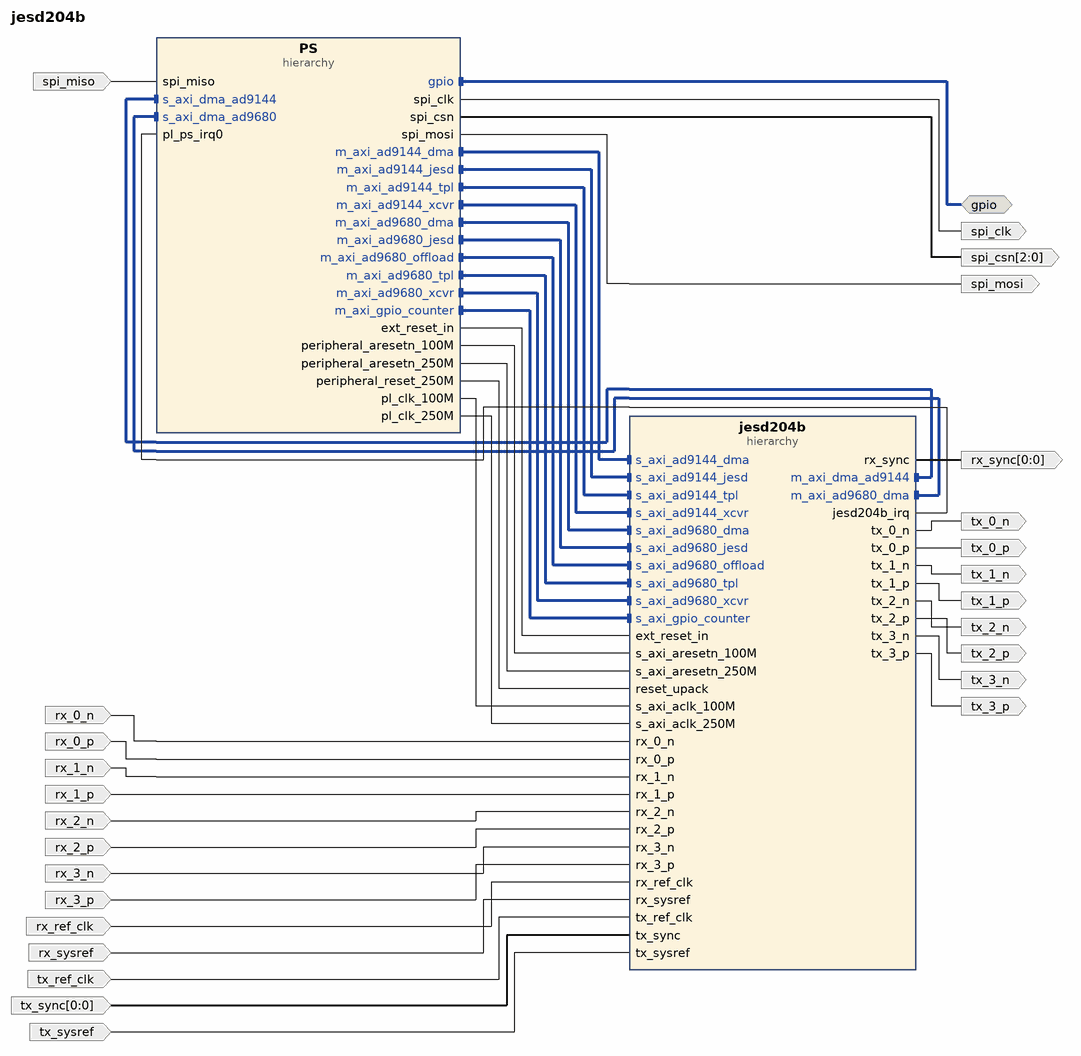
[diagram p0: block diagram of the top level]
# Vivado block design jesd204b, xczu7ev-fbvb900-1-e, Vivado 2022.2
create_bd_design jesd204b

create_bd_intf_port -mode Master -vlnv xilinx.com:interface:gpio_rtl:1.0 gpio
create_bd_port -dir O -from 2 -to 0 spi_csn
create_bd_port -dir O spi_clk
create_bd_port -dir O spi_mosi
create_bd_port -dir I spi_miso
create_bd_port -dir I rx_0_n
create_bd_port -dir I rx_0_p
create_bd_port -dir I rx_1_n
create_bd_port -dir I rx_1_p
create_bd_port -dir I rx_2_n
create_bd_port -dir I rx_2_p
create_bd_port -dir I rx_3_n
create_bd_port -dir I rx_3_p
create_bd_port -dir I rx_ref_clk
create_bd_port -dir I tx_ref_clk
create_bd_port -dir O tx_0_n
create_bd_port -dir O tx_0_p
create_bd_port -dir O tx_1_n
create_bd_port -dir O tx_1_p
create_bd_port -dir O tx_2_n
create_bd_port -dir O tx_2_p
create_bd_port -dir O tx_3_n
create_bd_port -dir O tx_3_p
create_bd_port -dir O -from 0 -to 0 rx_sync
create_bd_port -dir I rx_sysref
create_bd_port -dir I tx_sysref
create_bd_port -dir I -from 0 -to 0 tx_sync

create_bd_cell -type hier PS
create_bd_cell -type hier jesd204b

# ---- hierarchy /PS ----
current_bd_instance /PS
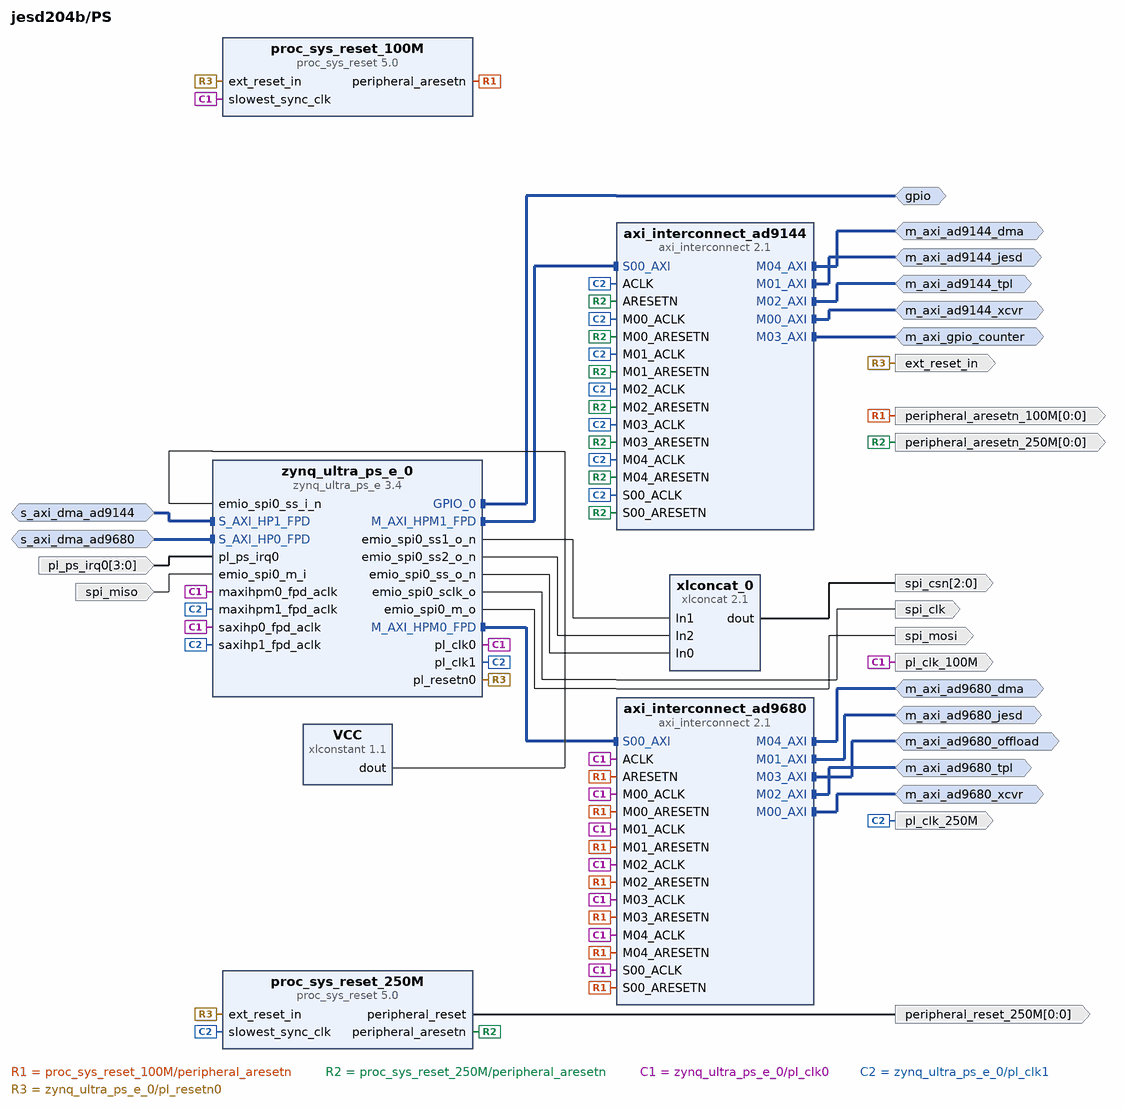
[diagram p1: block diagram inside /PS]
create_bd_intf_pin -mode Slave -vlnv xilinx.com:interface:aximm_rtl:1.0 s_axi_dma_ad9680
create_bd_intf_pin -mode Slave -vlnv xilinx.com:interface:aximm_rtl:1.0 s_axi_dma_ad9144
create_bd_intf_pin -mode Master -vlnv xilinx.com:interface:gpio_rtl:1.0 gpio
create_bd_intf_pin -mode Master -vlnv xilinx.com:interface:aximm_rtl:1.0 m_axi_ad9144_xcvr
create_bd_intf_pin -mode Master -vlnv xilinx.com:interface:aximm_rtl:1.0 m_axi_ad9144_jesd
create_bd_intf_pin -mode Master -vlnv xilinx.com:interface:aximm_rtl:1.0 m_axi_ad9144_tpl
create_bd_intf_pin -mode Master -vlnv xilinx.com:interface:aximm_rtl:1.0 m_axi_gpio_counter
create_bd_intf_pin -mode Master -vlnv xilinx.com:interface:aximm_rtl:1.0 m_axi_ad9144_dma
create_bd_intf_pin -mode Master -vlnv xilinx.com:interface:aximm_rtl:1.0 m_axi_ad9680_xcvr
create_bd_intf_pin -mode Master -vlnv xilinx.com:interface:aximm_rtl:1.0 m_axi_ad9680_jesd
create_bd_intf_pin -mode Master -vlnv xilinx.com:interface:aximm_rtl:1.0 m_axi_ad9680_tpl
create_bd_intf_pin -mode Master -vlnv xilinx.com:interface:aximm_rtl:1.0 m_axi_ad9680_offload
create_bd_intf_pin -mode Master -vlnv xilinx.com:interface:aximm_rtl:1.0 m_axi_ad9680_dma
create_bd_pin -dir O -from 2 -to 0 spi_csn
create_bd_pin -dir O spi_clk
create_bd_pin -dir I spi_miso
create_bd_pin -dir O spi_mosi
create_bd_pin -dir I -from 3 -to 0 pl_ps_irq0
create_bd_pin -dir O pl_clk_250M
create_bd_pin -dir O pl_clk_100M
create_bd_pin -dir O -from 0 -to 0 peripheral_aresetn_100M
create_bd_pin -dir O -from 0 -to 0 peripheral_aresetn_250M
create_bd_pin -dir O -from 0 -to 0 peripheral_reset_250M
create_bd_pin -dir O ext_reset_in

create_bd_cell -type ip -vlnv xilinx.com:ip:zynq_ultra_ps_e:3.4 zynq_ultra_ps_e_0
set_property -dict [list \
  CONFIG.PSU_BANK_0_IO_STANDARD LVCMOS18 \
  CONFIG.PSU_BANK_1_IO_STANDARD LVCMOS18 \
  CONFIG.PSU_BANK_2_IO_STANDARD LVCMOS18 \
  CONFIG.PSU_BANK_3_IO_STANDARD LVCMOS18 \
  CONFIG.PSU__CRF_APB__ACPU_CTRL__FREQMHZ 1200 \
  CONFIG.PSU__CRF_APB__ACPU_CTRL__SRCSEL DPLL \
  CONFIG.PSU__CRF_APB__APLL_CTRL__SRCSEL PSS_REF_CLK \
  CONFIG.PSU__CRF_APB__DBG_FPD_CTRL__FREQMHZ 250 \
  CONFIG.PSU__CRF_APB__DBG_FPD_CTRL__SRCSEL IOPLL \
  CONFIG.PSU__CRF_APB__DBG_TRACE_CTRL__FREQMHZ 250 \
  CONFIG.PSU__CRF_APB__DBG_TRACE_CTRL__SRCSEL IOPLL \
  CONFIG.PSU__CRF_APB__DBG_TSTMP_CTRL__FREQMHZ 250 \
  CONFIG.PSU__CRF_APB__DBG_TSTMP_CTRL__SRCSEL IOPLL \
  CONFIG.PSU__CRF_APB__DDR_CTRL__FREQMHZ 1200 \
  CONFIG.PSU__CRF_APB__DDR_CTRL__SRCSEL DPLL \
  CONFIG.PSU__CRF_APB__DPDMA_REF_CTRL__FREQMHZ 600 \
  CONFIG.PSU__CRF_APB__DPDMA_REF_CTRL__SRCSEL DPLL \
  CONFIG.PSU__CRF_APB__DPLL_CTRL__SRCSEL PSS_REF_CLK \
  CONFIG.PSU__CRF_APB__GDMA_REF_CTRL__FREQMHZ 600 \
  CONFIG.PSU__CRF_APB__GDMA_REF_CTRL__SRCSEL DPLL \
  CONFIG.PSU__CRF_APB__GPU_REF_CTRL__FREQMHZ 500 \
  CONFIG.PSU__CRF_APB__GPU_REF_CTRL__SRCSEL IOPLL \
  CONFIG.PSU__CRF_APB__TOPSW_LSBUS_CTRL__FREQMHZ 100 \
  CONFIG.PSU__CRF_APB__TOPSW_LSBUS_CTRL__SRCSEL IOPLL \
  CONFIG.PSU__CRF_APB__TOPSW_MAIN_CTRL__FREQMHZ 533.33 \
  CONFIG.PSU__CRF_APB__TOPSW_MAIN_CTRL__SRCSEL APLL \
  CONFIG.PSU__CRF_APB__VPLL_CTRL__SRCSEL PSS_REF_CLK \
  CONFIG.PSU__CRL_APB__ADMA_REF_CTRL__FREQMHZ 500 \
  CONFIG.PSU__CRL_APB__ADMA_REF_CTRL__SRCSEL IOPLL \
  CONFIG.PSU__CRL_APB__CPU_R5_CTRL__FREQMHZ 500 \
  CONFIG.PSU__CRL_APB__CPU_R5_CTRL__SRCSEL IOPLL \
  CONFIG.PSU__CRL_APB__DBG_LPD_CTRL__FREQMHZ 250 \
  CONFIG.PSU__CRL_APB__DBG_LPD_CTRL__SRCSEL IOPLL \
  CONFIG.PSU__CRL_APB__I2C0_REF_CTRL__FREQMHZ 100 \
  CONFIG.PSU__CRL_APB__I2C0_REF_CTRL__SRCSEL IOPLL \
  CONFIG.PSU__CRL_APB__IOPLL_CTRL__SRCSEL PSS_REF_CLK \
  CONFIG.PSU__CRL_APB__IOU_SWITCH_CTRL__FREQMHZ 250 \
  CONFIG.PSU__CRL_APB__IOU_SWITCH_CTRL__SRCSEL IOPLL \
  CONFIG.PSU__CRL_APB__LPD_LSBUS_CTRL__SRCSEL IOPLL \
  CONFIG.PSU__CRL_APB__LPD_SWITCH_CTRL__FREQMHZ 500 \
  CONFIG.PSU__CRL_APB__LPD_SWITCH_CTRL__SRCSEL IOPLL \
  CONFIG.PSU__CRL_APB__PCAP_CTRL__FREQMHZ 200 \
  CONFIG.PSU__CRL_APB__PCAP_CTRL__SRCSEL IOPLL \
  CONFIG.PSU__CRL_APB__PL0_REF_CTRL__FREQMHZ 100 \
  CONFIG.PSU__CRL_APB__PL0_REF_CTRL__SRCSEL IOPLL \
  CONFIG.PSU__CRL_APB__PL1_REF_CTRL__FREQMHZ 250 \
  CONFIG.PSU__CRL_APB__PL1_REF_CTRL__SRCSEL IOPLL \
  CONFIG.PSU__CRL_APB__RPLL_CTRL__SRCSEL PSS_REF_CLK \
  CONFIG.PSU__CRL_APB__SDIO0_REF_CTRL__SRCSEL IOPLL \
  CONFIG.PSU__CRL_APB__SDIO1_REF_CTRL__FREQMHZ 200 \
  CONFIG.PSU__CRL_APB__SDIO1_REF_CTRL__SRCSEL IOPLL \
  CONFIG.PSU__CRL_APB__TIMESTAMP_REF_CTRL__FREQMHZ 100 \
  CONFIG.PSU__CRL_APB__TIMESTAMP_REF_CTRL__SRCSEL IOPLL \
  CONFIG.PSU__CRL_APB__UART0_REF_CTRL__FREQMHZ 100 \
  CONFIG.PSU__CRL_APB__UART0_REF_CTRL__SRCSEL IOPLL \
  CONFIG.PSU__CRL_APB__UART1_REF_CTRL__FREQMHZ 100 \
  CONFIG.PSU__CRL_APB__UART1_REF_CTRL__SRCSEL IOPLL \
  CONFIG.PSU__DDRC__BUS_WIDTH {64 Bit} \
  CONFIG.PSU__DDRC__COMPONENTS Components \
  CONFIG.PSU__DDRC__DEVICE_CAPACITY {8192 MBits} \
  CONFIG.PSU__DDRC__DRAM_WIDTH {16 Bits} \
  CONFIG.PSU__DDRC__ECC Enabled \
  CONFIG.PSU__DDRC__MEMORY_TYPE {DDR 4} \
  CONFIG.PSU__DDRC__SPEED_BIN DDR4_2400R \
  CONFIG.PSU__DDR_HIGH_ADDRESS_GUI_ENABLE 1 \
  CONFIG.PSU__DDR__INTERFACE__FREQMHZ 600.000 \
  CONFIG.PSU__DLL__ISUSED 1 \
  CONFIG.PSU__ENET0__GRP_MDIO__ENABLE 1 \
  CONFIG.PSU__ENET0__GRP_MDIO__IO {MIO 76 .. 77} \
  CONFIG.PSU__ENET0__PERIPHERAL__ENABLE 1 \
  CONFIG.PSU__ENET0__PERIPHERAL__IO {MIO 26 .. 37} \
  CONFIG.PSU__FPGA_PL0_ENABLE 1 \
  CONFIG.PSU__FPGA_PL1_ENABLE 1 \
  CONFIG.PSU__GEM__TSU__ENABLE 0 \
  CONFIG.PSU__GPIO0_MIO__IO {MIO 0 .. 25} \
  CONFIG.PSU__GPIO0_MIO__PERIPHERAL__ENABLE 1 \
  CONFIG.PSU__GPIO1_MIO__IO {MIO 26 .. 51} \
  CONFIG.PSU__GPIO1_MIO__PERIPHERAL__ENABLE 1 \
  CONFIG.PSU__GPIO_EMIO_WIDTH 95 \
  CONFIG.PSU__GPIO_EMIO__PERIPHERAL__ENABLE 1 \
  CONFIG.PSU__GPIO_EMIO__PERIPHERAL__IO 95 \
  CONFIG.PSU__I2C0__PERIPHERAL__ENABLE 1 \
  CONFIG.PSU__I2C0__PERIPHERAL__IO {MIO 10 .. 11} \
  CONFIG.PSU__IOU_SLCR__IOU_TTC_APB_CLK__TTC0_SEL APB \
  CONFIG.PSU__IOU_SLCR__IOU_TTC_APB_CLK__TTC1_SEL APB \
  CONFIG.PSU__IOU_SLCR__IOU_TTC_APB_CLK__TTC2_SEL APB \
  CONFIG.PSU__IOU_SLCR__IOU_TTC_APB_CLK__TTC3_SEL APB \
  CONFIG.PSU__MAXIGP0__DATA_WIDTH 128 \
  CONFIG.PSU__OVERRIDE__BASIC_CLOCK 0 \
  CONFIG.PSU__PRESET_APPLIED 1 \
  CONFIG.PSU__PSS_REF_CLK__FREQMHZ 33.333333 \
  CONFIG.PSU__SD0__CLK_200_SDR_OTAP_DLY 0x3 \
  CONFIG.PSU__SD0__CLK_50_DDR_ITAP_DLY 0x12 \
  CONFIG.PSU__SD0__CLK_50_DDR_OTAP_DLY 0x6 \
  CONFIG.PSU__SD0__CLK_50_SDR_ITAP_DLY 0x15 \
  CONFIG.PSU__SD0__CLK_50_SDR_OTAP_DLY 0x6 \
  CONFIG.PSU__SD0__DATA_TRANSFER_MODE 8Bit \
  CONFIG.PSU__SD0__GRP_POW__ENABLE 1 \
  CONFIG.PSU__SD0__GRP_POW__IO {MIO 23} \
  CONFIG.PSU__SD0__PERIPHERAL__ENABLE 1 \
  CONFIG.PSU__SD0__PERIPHERAL__IO {MIO 13 .. 22} \
  CONFIG.PSU__SD0__RESET__ENABLE 1 \
  CONFIG.PSU__SD0__SLOT_TYPE eMMC \
  CONFIG.PSU__SD1_COHERENCY 0 \
  CONFIG.PSU__SD1_ROUTE_THROUGH_FPD 0 \
  CONFIG.PSU__SD1__CLK_50_SDR_ITAP_DLY 0x15 \
  CONFIG.PSU__SD1__CLK_50_SDR_OTAP_DLY 0x5 \
  CONFIG.PSU__SD1__DATA_TRANSFER_MODE 4Bit \
  CONFIG.PSU__SD1__GRP_CD__ENABLE 1 \
  CONFIG.PSU__SD1__GRP_CD__IO {MIO 45} \
  CONFIG.PSU__SD1__GRP_POW__ENABLE 0 \
  CONFIG.PSU__SD1__GRP_WP__ENABLE 1 \
  CONFIG.PSU__SD1__GRP_WP__IO {MIO 44} \
  CONFIG.PSU__SD1__PERIPHERAL__ENABLE 1 \
  CONFIG.PSU__SD1__PERIPHERAL__IO {MIO 46 .. 51} \
  CONFIG.PSU__SD1__SLOT_TYPE {SD 2.0} \
  CONFIG.PSU__SPI0__GRP_SS0__IO EMIO \
  CONFIG.PSU__SPI0__GRP_SS1__ENABLE 1 \
  CONFIG.PSU__SPI0__GRP_SS1__IO EMIO \
  CONFIG.PSU__SPI0__GRP_SS2__ENABLE 1 \
  CONFIG.PSU__SPI0__GRP_SS2__IO EMIO \
  CONFIG.PSU__SPI0__PERIPHERAL__ENABLE 1 \
  CONFIG.PSU__SPI0__PERIPHERAL__IO EMIO \
  CONFIG.PSU__SWDT0__CLOCK__ENABLE 0 \
  CONFIG.PSU__SWDT0__PERIPHERAL__ENABLE 1 \
  CONFIG.PSU__SWDT0__RESET__ENABLE 0 \
  CONFIG.PSU__SWDT1__CLOCK__ENABLE 0 \
  CONFIG.PSU__SWDT1__PERIPHERAL__ENABLE 1 \
  CONFIG.PSU__SWDT1__RESET__ENABLE 0 \
  CONFIG.PSU__TSU__BUFG_PORT_PAIR 0 \
  CONFIG.PSU__TTC0__CLOCK__ENABLE 0 \
  CONFIG.PSU__TTC0__PERIPHERAL__ENABLE 1 \
  CONFIG.PSU__TTC0__WAVEOUT__ENABLE 0 \
  CONFIG.PSU__TTC1__CLOCK__ENABLE 0 \
  CONFIG.PSU__TTC1__PERIPHERAL__ENABLE 1 \
  CONFIG.PSU__TTC1__WAVEOUT__ENABLE 0 \
  CONFIG.PSU__TTC2__CLOCK__ENABLE 0 \
  CONFIG.PSU__TTC2__PERIPHERAL__ENABLE 1 \
  CONFIG.PSU__TTC2__WAVEOUT__ENABLE 0 \
  CONFIG.PSU__TTC3__CLOCK__ENABLE 0 \
  CONFIG.PSU__TTC3__PERIPHERAL__ENABLE 1 \
  CONFIG.PSU__TTC3__WAVEOUT__ENABLE 0 \
  CONFIG.PSU__UART0__BAUD_RATE 115200 \
  CONFIG.PSU__UART0__MODEM__ENABLE 0 \
  CONFIG.PSU__UART0__PERIPHERAL__ENABLE 1 \
  CONFIG.PSU__UART0__PERIPHERAL__IO {MIO 6 .. 7} \
  CONFIG.PSU__UART1__BAUD_RATE 115200 \
  CONFIG.PSU__UART1__MODEM__ENABLE 0 \
  CONFIG.PSU__UART1__PERIPHERAL__ENABLE 1 \
  CONFIG.PSU__UART1__PERIPHERAL__IO {MIO 8 .. 9} \
  CONFIG.PSU__USE__IRQ0 1 \
  CONFIG.PSU__USE__M_AXI_GP0 1 \
  CONFIG.PSU__USE__M_AXI_GP1 1 \
  CONFIG.PSU__USE__M_AXI_GP2 0 \
  CONFIG.PSU__USE__S_AXI_GP2 1 \
  CONFIG.PSU__USE__S_AXI_GP3 1 \
] [get_bd_cells zynq_ultra_ps_e_0]
# 113 more settings of zynq_ultra_ps_e_0 are not shown: defaults, MIO pin electricals, DDR timing, and values the tool derives
create_bd_cell -type ip -vlnv xilinx.com:ip:xlconstant:1.1 VCC
create_bd_cell -type ip -vlnv xilinx.com:ip:xlconcat:2.1 xlconcat_0
set_property -dict {CONFIG.NUM_PORTS 3} [get_bd_cells xlconcat_0]
create_bd_cell -type ip -vlnv xilinx.com:ip:axi_interconnect:2.1 axi_interconnect_ad9144
set_property -dict {CONFIG.NUM_MI 5} [get_bd_cells axi_interconnect_ad9144]
create_bd_cell -type ip -vlnv xilinx.com:ip:axi_interconnect:2.1 axi_interconnect_ad9680
set_property -dict {CONFIG.NUM_MI 5} [get_bd_cells axi_interconnect_ad9680]
create_bd_cell -type ip -vlnv xilinx.com:ip:proc_sys_reset:5.0 proc_sys_reset_100M
create_bd_cell -type ip -vlnv xilinx.com:ip:proc_sys_reset:5.0 proc_sys_reset_250M

# ---- hierarchy /jesd204b ----
current_bd_instance /jesd204b
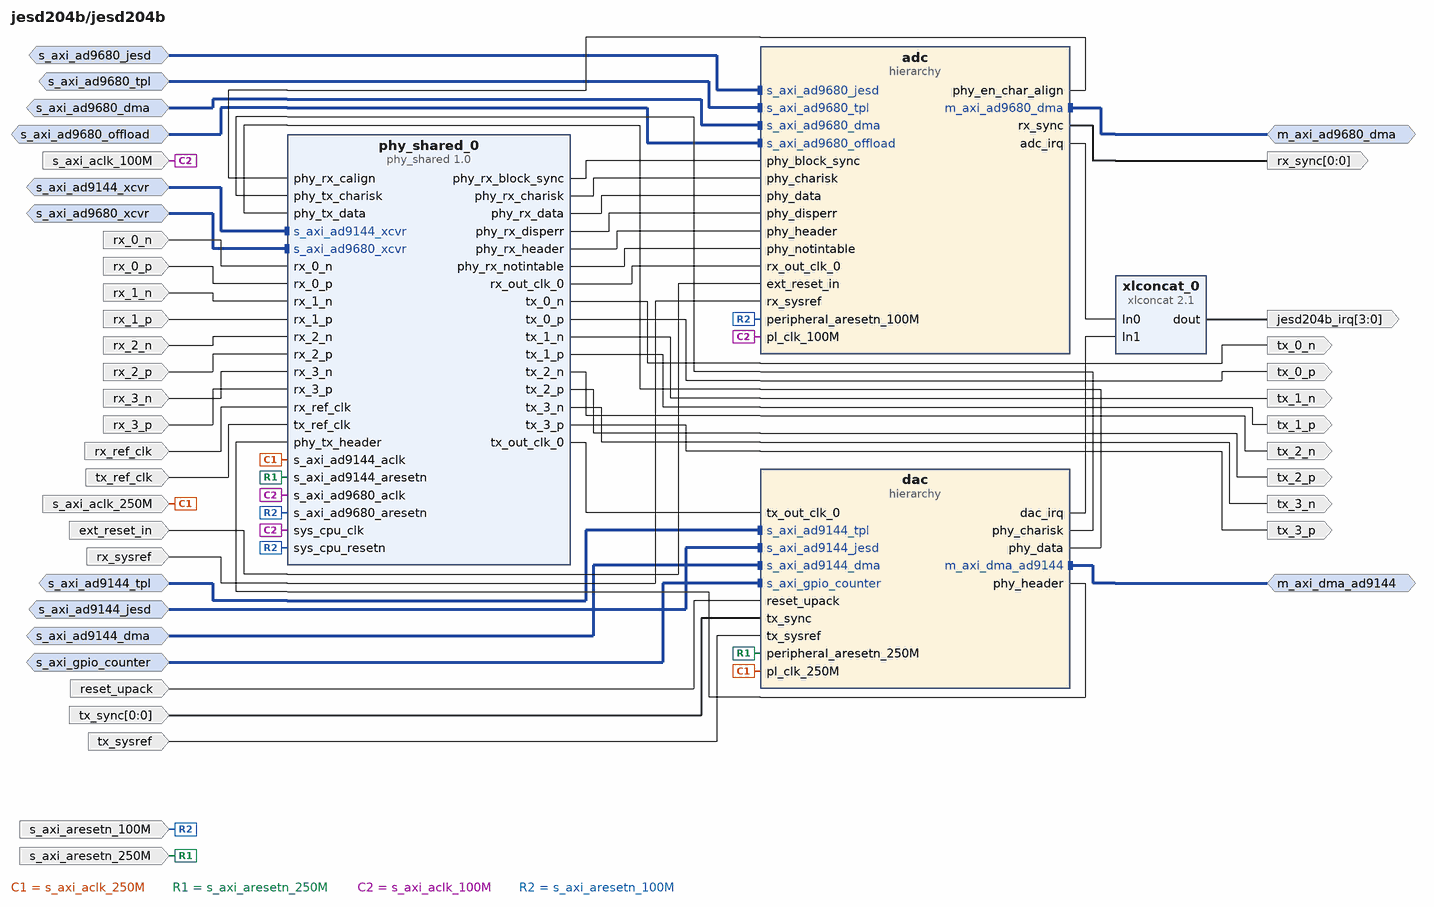
[diagram p2: block diagram inside /jesd204b]
create_bd_intf_pin -mode Slave -vlnv xilinx.com:interface:aximm_rtl:1.0 s_axi_ad9144_xcvr
create_bd_intf_pin -mode Slave -vlnv xilinx.com:interface:aximm_rtl:1.0 s_axi_ad9680_xcvr
create_bd_intf_pin -mode Master -vlnv xilinx.com:interface:aximm_rtl:1.0 m_axi_ad9680_dma
create_bd_intf_pin -mode Slave -vlnv xilinx.com:interface:aximm_rtl:1.0 s_axi_ad9680_jesd
create_bd_intf_pin -mode Slave -vlnv xilinx.com:interface:aximm_rtl:1.0 s_axi_ad9680_tpl
create_bd_intf_pin -mode Slave -vlnv xilinx.com:interface:aximm_rtl:1.0 s_axi_ad9680_dma
create_bd_intf_pin -mode Slave -vlnv xilinx.com:interface:aximm_rtl:1.0 s_axi_ad9680_offload
create_bd_intf_pin -mode Slave -vlnv xilinx.com:interface:aximm_rtl:1.0 s_axi_ad9144_tpl
create_bd_intf_pin -mode Slave -vlnv xilinx.com:interface:aximm_rtl:1.0 s_axi_ad9144_jesd
create_bd_intf_pin -mode Slave -vlnv xilinx.com:interface:aximm_rtl:1.0 s_axi_ad9144_dma
create_bd_intf_pin -mode Slave -vlnv xilinx.com:interface:aximm_rtl:1.0 s_axi_gpio_counter
create_bd_intf_pin -mode Master -vlnv xilinx.com:interface:aximm_rtl:1.0 m_axi_dma_ad9144
create_bd_pin -dir I rx_0_n
create_bd_pin -dir I rx_0_p
create_bd_pin -dir I rx_1_n
create_bd_pin -dir I rx_1_p
create_bd_pin -dir I rx_2_n
create_bd_pin -dir I rx_2_p
create_bd_pin -dir I rx_3_n
create_bd_pin -dir I rx_3_p
create_bd_pin -dir I rx_ref_clk
create_bd_pin -dir I tx_ref_clk
create_bd_pin -dir O tx_0_n
create_bd_pin -dir O tx_0_p
create_bd_pin -dir O tx_1_n
create_bd_pin -dir O tx_1_p
create_bd_pin -dir O tx_2_n
create_bd_pin -dir O tx_2_p
create_bd_pin -dir O tx_3_n
create_bd_pin -dir O tx_3_p
create_bd_pin -dir I -type rst s_axi_aresetn_100M
create_bd_pin -dir I -type clk s_axi_aclk_100M
create_bd_pin -dir I -type clk s_axi_aclk_250M
create_bd_pin -dir I -type rst s_axi_aresetn_250M
create_bd_pin -dir I -type rst ext_reset_in
create_bd_pin -dir O -from 0 -to 0 rx_sync
create_bd_pin -dir O -from 3 -to 0 jesd204b_irq
create_bd_pin -dir I rx_sysref
create_bd_pin -dir I reset_upack
create_bd_pin -dir I tx_sysref
create_bd_pin -dir I -from 0 -to 0 tx_sync

create_bd_cell -type ip -vlnv analog.devices:user:phy_shared:1.0 phy_shared_0
create_bd_cell -type hier adc
create_bd_cell -type ip -vlnv xilinx.com:ip:xlconcat:2.1 xlconcat_0
create_bd_cell -type hier dac

# ---- hierarchy /jesd204b/adc ----
current_bd_instance /jesd204b/adc
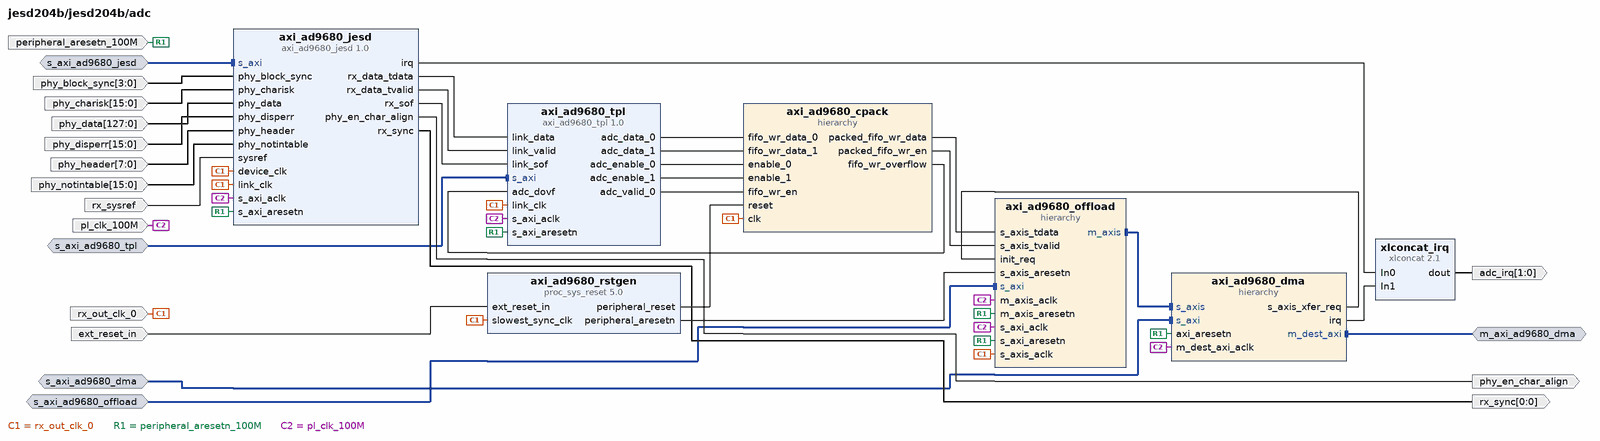
[diagram p3: block diagram inside /jesd204b/adc]
create_bd_intf_pin -mode Slave -vlnv xilinx.com:interface:aximm_rtl:1.0 s_axi_ad9680_jesd
create_bd_intf_pin -mode Slave -vlnv xilinx.com:interface:aximm_rtl:1.0 s_axi_ad9680_tpl
create_bd_intf_pin -mode Slave -vlnv xilinx.com:interface:aximm_rtl:1.0 s_axi_ad9680_offload
create_bd_intf_pin -mode Slave -vlnv xilinx.com:interface:aximm_rtl:1.0 s_axi_ad9680_dma
create_bd_intf_pin -mode Master -vlnv xilinx.com:interface:aximm_rtl:1.0 m_axi_ad9680_dma
create_bd_pin -dir I -type clk pl_clk_100M
create_bd_pin -dir I -type clk rx_out_clk_0
create_bd_pin -dir I -from 3 -to 0 phy_block_sync
create_bd_pin -dir I -from 15 -to 0 phy_charisk
create_bd_pin -dir I -from 127 -to 0 phy_data
create_bd_pin -dir I -from 15 -to 0 phy_disperr
create_bd_pin -dir I -from 7 -to 0 phy_header
create_bd_pin -dir I -from 15 -to 0 phy_notintable
create_bd_pin -dir I -type rst peripheral_aresetn_100M
create_bd_pin -dir I rx_sysref
create_bd_pin -dir O -from 1 -to 0 adc_irq
create_bd_pin -dir O phy_en_char_align
create_bd_pin -dir O -from 0 -to 0 rx_sync
create_bd_pin -dir I -type rst ext_reset_in

create_bd_cell -type ip -vlnv analog.devices:user:axi_ad9680_jesd:1.0 axi_ad9680_jesd
create_bd_cell -type ip -vlnv xilinx.com:ip:proc_sys_reset:5.0 axi_ad9680_rstgen
create_bd_cell -type ip -vlnv xilinx.com:ip:xlconcat:2.1 xlconcat_irq
create_bd_cell -type hier axi_ad9680_offload
create_bd_cell -type hier axi_ad9680_dma
create_bd_cell -type hier axi_ad9680_cpack
create_bd_cell -type ip -vlnv analog.devices:user:axi_ad9680_tpl:1.0 axi_ad9680_tpl

# ---- hierarchy /jesd204b/adc/axi_ad9680_offload ----
current_bd_instance /jesd204b/adc/axi_ad9680_offload
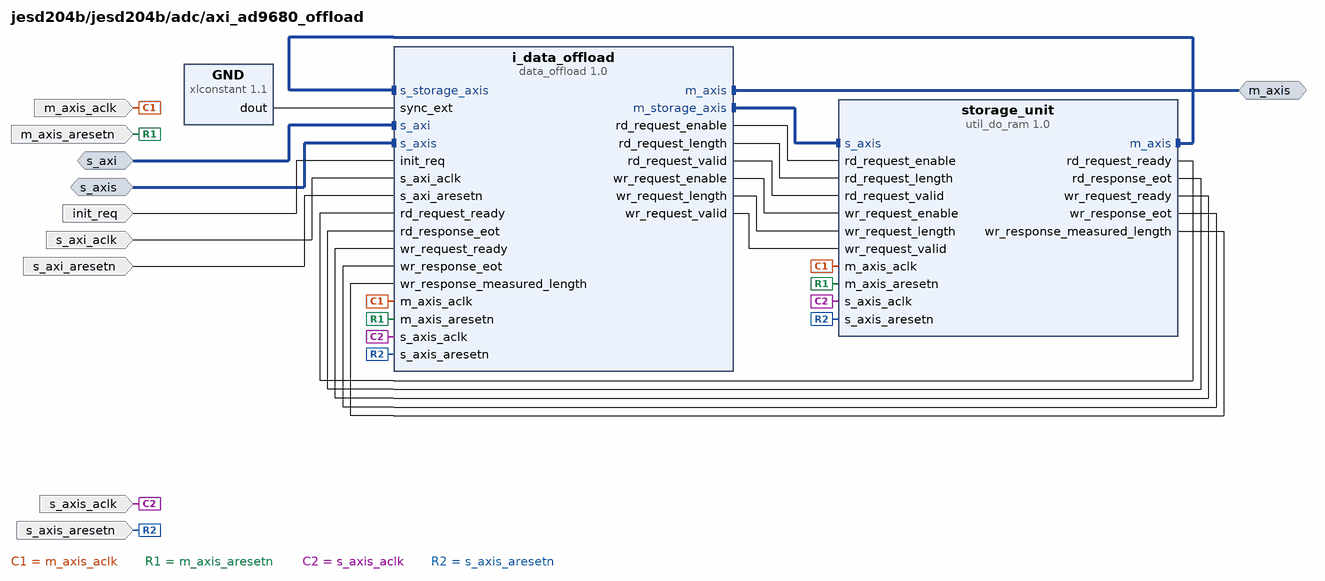
[diagram p4: block diagram inside /jesd204b/adc/axi_ad9680_offload]
create_bd_intf_pin -mode Slave -vlnv xilinx.com:interface:aximm_rtl:1.0 s_axi
create_bd_intf_pin -mode Slave -vlnv xilinx.com:interface:axis_rtl:1.0 s_axis
create_bd_intf_pin -mode Master -vlnv xilinx.com:interface:axis_rtl:1.0 m_axis
create_bd_pin -dir I s_axis_aclk
create_bd_pin -dir I s_axis_aresetn
create_bd_pin -dir I m_axis_aclk
create_bd_pin -dir I m_axis_aresetn
create_bd_pin -dir I s_axi_aclk
create_bd_pin -dir I s_axi_aresetn
create_bd_pin -dir I init_req

create_bd_cell -type ip -vlnv analog.devices:user:util_do_ram:1.0 storage_unit
set_property -dict {CONFIG.LENGTH_WIDTH 20 CONFIG.SRC_DATA_WIDTH 128} [get_bd_cells storage_unit]
create_bd_cell -type ip -vlnv analog.devices:user:data_offload:1.0 i_data_offload
set_property -dict {CONFIG.MEM_SIZE_LOG2 20 CONFIG.SRC_DATA_WIDTH 128} [get_bd_cells i_data_offload]
create_bd_cell -type ip -vlnv xilinx.com:ip:xlconstant:1.1 GND
set_property -dict {CONFIG.CONST_VAL 0} [get_bd_cells GND]

# ---- hierarchy /jesd204b/adc/axi_ad9680_dma ----
current_bd_instance /jesd204b/adc/axi_ad9680_dma
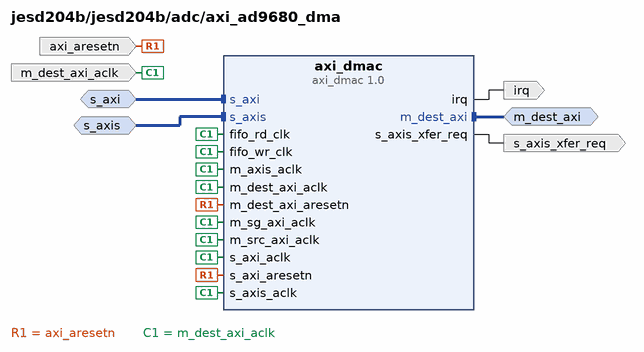
[diagram p5: block diagram inside /jesd204b/adc/axi_ad9680_dma]
create_bd_intf_pin -mode Slave -vlnv xilinx.com:interface:aximm_rtl:1.0 s_axi
create_bd_intf_pin -mode Slave -vlnv xilinx.com:interface:axis_rtl:1.0 s_axis
create_bd_intf_pin -mode Master -vlnv xilinx.com:interface:aximm_rtl:1.0 m_dest_axi
create_bd_pin -dir I m_dest_axi_aclk
create_bd_pin -dir I axi_aresetn
create_bd_pin -dir O irq
create_bd_pin -dir O s_axis_xfer_req

create_bd_cell -type ip -vlnv analog.devices:user:axi_dmac:1.0 axi_dmac
set_property -dict [list \
  CONFIG.CYCLIC 0 \
  CONFIG.DMA_DATA_WIDTH_DEST 128 \
  CONFIG.DMA_DATA_WIDTH_SRC 128 \
  CONFIG.DMA_TYPE_SRC 1 \
  CONFIG.MAX_BYTES_PER_BURST 256 \
] [get_bd_cells axi_dmac]

# ---- hierarchy /jesd204b/adc/axi_ad9680_cpack ----
current_bd_instance /jesd204b/adc/axi_ad9680_cpack
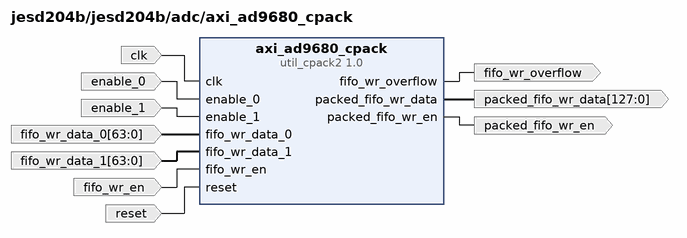
[diagram p6: block diagram inside /jesd204b/adc/axi_ad9680_cpack]
create_bd_pin -dir I clk
create_bd_pin -dir I reset
create_bd_pin -dir I enable_0
create_bd_pin -dir I enable_1
create_bd_pin -dir I fifo_wr_en
create_bd_pin -dir I -from 63 -to 0 fifo_wr_data_0
create_bd_pin -dir I -from 63 -to 0 fifo_wr_data_1
create_bd_pin -dir O fifo_wr_overflow
create_bd_pin -dir O packed_fifo_wr_en
create_bd_pin -dir O -from 127 -to 0 packed_fifo_wr_data

create_bd_cell -type ip -vlnv analog.devices:user:util_cpack2:1.0 axi_ad9680_cpack
set_property -dict {CONFIG.NUM_OF_CHANNELS 2 CONFIG.SAMPLES_PER_CHANNEL 4} [get_bd_cells axi_ad9680_cpack]

# ---- hierarchy /jesd204b/dac ----
current_bd_instance /jesd204b/dac
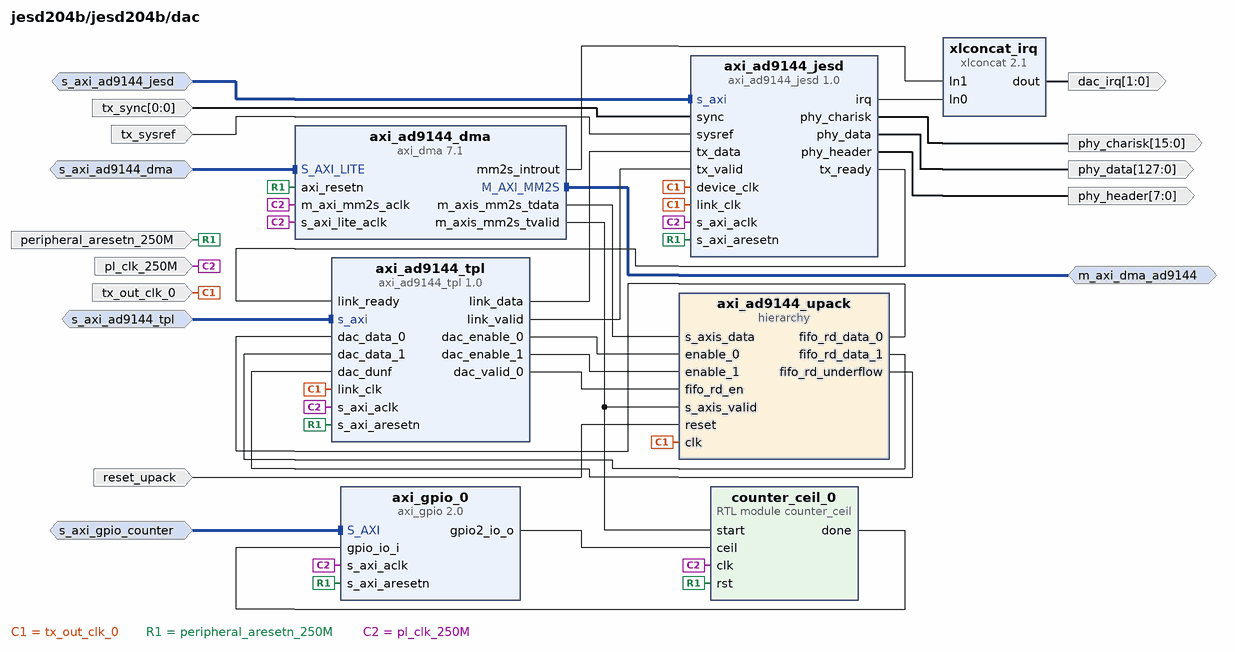
[diagram p7: block diagram inside /jesd204b/dac]
create_bd_intf_pin -mode Slave -vlnv xilinx.com:interface:aximm_rtl:1.0 s_axi_ad9144_tpl
create_bd_intf_pin -mode Slave -vlnv xilinx.com:interface:aximm_rtl:1.0 s_axi_ad9144_jesd
create_bd_intf_pin -mode Slave -vlnv xilinx.com:interface:aximm_rtl:1.0 s_axi_ad9144_dma
create_bd_intf_pin -mode Master -vlnv xilinx.com:interface:aximm_rtl:1.0 m_axi_dma_ad9144
create_bd_intf_pin -mode Slave -vlnv xilinx.com:interface:aximm_rtl:1.0 s_axi_gpio_counter
create_bd_pin -dir I tx_out_clk_0
create_bd_pin -dir I reset_upack
create_bd_pin -dir O -from 1 -to 0 dac_irq
create_bd_pin -dir I -type clk pl_clk_250M
create_bd_pin -dir I -type rst peripheral_aresetn_250M
create_bd_pin -dir I tx_sysref
create_bd_pin -dir I -from 0 -to 0 tx_sync
create_bd_pin -dir O -from 15 -to 0 phy_charisk
create_bd_pin -dir O -from 127 -to 0 phy_data
create_bd_pin -dir O -from 7 -to 0 phy_header

create_bd_cell -type hier axi_ad9144_upack
create_bd_cell -type ip -vlnv analog.devices:user:axi_ad9144_jesd:1.0 axi_ad9144_jesd
create_bd_cell -type ip -vlnv xilinx.com:ip:xlconcat:2.1 xlconcat_irq
create_bd_cell -type ip -vlnv xilinx.com:ip:axi_dma:7.1 axi_ad9144_dma
set_property -dict [list \
  CONFIG.c_include_s2mm 0 \
  CONFIG.c_include_sg 0 \
  CONFIG.c_m_axi_mm2s_data_width 128 \
  CONFIG.c_m_axis_mm2s_tdata_width 128 \
  CONFIG.c_mm2s_burst_size 256 \
  CONFIG.c_sg_length_width 26 \
] [get_bd_cells axi_ad9144_dma]
create_bd_cell -type ip -vlnv xilinx.com:ip:axi_gpio:2.0 axi_gpio_0
set_property -dict [list \
  CONFIG.C_ALL_INPUTS 1 \
  CONFIG.C_ALL_OUTPUTS_2 1 \
  CONFIG.C_DOUT_DEFAULT_2 0x0000C350 \
  CONFIG.C_GPIO_WIDTH 1 \
  CONFIG.C_IS_DUAL 1 \
] [get_bd_cells axi_gpio_0]
create_bd_cell -type module -reference counter_ceil counter_ceil_0
create_bd_cell -type ip -vlnv analog.devices:user:axi_ad9144_tpl:1.0 axi_ad9144_tpl

# ---- hierarchy /jesd204b/dac/axi_ad9144_upack ----
current_bd_instance /jesd204b/dac/axi_ad9144_upack
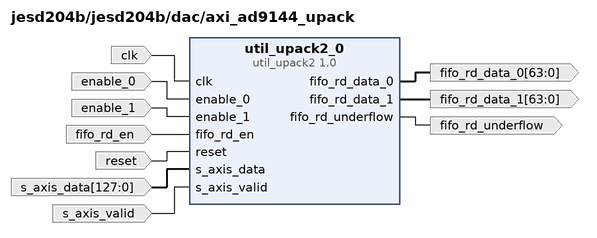
[diagram p8: block diagram inside /jesd204b/dac/axi_ad9144_upack]
create_bd_pin -dir I clk
create_bd_pin -dir I reset
create_bd_pin -dir I enable_0
create_bd_pin -dir I enable_1
create_bd_pin -dir O fifo_rd_underflow
create_bd_pin -dir O -from 63 -to 0 fifo_rd_data_0
create_bd_pin -dir O -from 63 -to 0 fifo_rd_data_1
create_bd_pin -dir I -from 127 -to 0 s_axis_data
create_bd_pin -dir I s_axis_valid
create_bd_pin -dir I fifo_rd_en

create_bd_cell -type ip -vlnv analog.devices:user:util_upack2:1.0 util_upack2_0
set_property -dict {CONFIG.NUM_OF_CHANNELS 2 CONFIG.SAMPLES_PER_CHANNEL 4} [get_bd_cells util_upack2_0]

# ---- connections ----

current_bd_instance /PS
connect_bd_intf_net [get_bd_intf_pins m_axi_ad9144_xcvr] [get_bd_intf_pins axi_interconnect_ad9144/M00_AXI]
connect_bd_intf_net [get_bd_intf_pins m_axi_ad9144_jesd] [get_bd_intf_pins axi_interconnect_ad9144/M01_AXI]
connect_bd_intf_net [get_bd_intf_pins m_axi_ad9144_tpl] [get_bd_intf_pins axi_interconnect_ad9144/M02_AXI]
connect_bd_intf_net [get_bd_intf_pins m_axi_gpio_counter] [get_bd_intf_pins axi_interconnect_ad9144/M03_AXI]
connect_bd_intf_net [get_bd_intf_pins m_axi_ad9144_dma] [get_bd_intf_pins axi_interconnect_ad9144/M04_AXI]
connect_bd_intf_net [get_bd_intf_pins m_axi_ad9680_xcvr] [get_bd_intf_pins axi_interconnect_ad9680/M00_AXI]
connect_bd_intf_net [get_bd_intf_pins m_axi_ad9680_jesd] [get_bd_intf_pins axi_interconnect_ad9680/M01_AXI]
connect_bd_intf_net [get_bd_intf_pins m_axi_ad9680_tpl] [get_bd_intf_pins axi_interconnect_ad9680/M02_AXI]
connect_bd_intf_net [get_bd_intf_pins m_axi_ad9680_offload] [get_bd_intf_pins axi_interconnect_ad9680/M03_AXI]
connect_bd_intf_net [get_bd_intf_pins m_axi_ad9680_dma] [get_bd_intf_pins axi_interconnect_ad9680/M04_AXI]
connect_bd_intf_net -intf_net s_axi_dma_ad9144_1 [get_bd_intf_pins s_axi_dma_ad9144] [get_bd_intf_pins zynq_ultra_ps_e_0/S_AXI_HP1_FPD]
connect_bd_intf_net -intf_net s_axi_dma_ad9680_1 [get_bd_intf_pins s_axi_dma_ad9680] [get_bd_intf_pins zynq_ultra_ps_e_0/S_AXI_HP0_FPD]
connect_bd_intf_net [get_bd_intf_pins gpio] [get_bd_intf_pins zynq_ultra_ps_e_0/GPIO_0]
connect_bd_intf_net [get_bd_intf_pins zynq_ultra_ps_e_0/M_AXI_HPM0_FPD] [get_bd_intf_pins axi_interconnect_ad9680/S00_AXI]
connect_bd_intf_net [get_bd_intf_pins zynq_ultra_ps_e_0/M_AXI_HPM1_FPD] [get_bd_intf_pins axi_interconnect_ad9144/S00_AXI]
connect_bd_net [get_bd_pins VCC/dout] [get_bd_pins zynq_ultra_ps_e_0/emio_spi0_ss_i_n]
connect_bd_net -net pl_ps_irq0_1 [get_bd_pins pl_ps_irq0] [get_bd_pins zynq_ultra_ps_e_0/pl_ps_irq0]
connect_bd_net [get_bd_pins proc_sys_reset_100M/peripheral_aresetn] \
  [get_bd_pins axi_interconnect_ad9680/M04_ARESETN] [get_bd_pins axi_interconnect_ad9680/M03_ARESETN] \
  [get_bd_pins axi_interconnect_ad9680/M02_ARESETN] [get_bd_pins axi_interconnect_ad9680/M01_ARESETN] \
  [get_bd_pins axi_interconnect_ad9680/M00_ARESETN] [get_bd_pins axi_interconnect_ad9680/S00_ARESETN] \
  [get_bd_pins axi_interconnect_ad9680/ARESETN] [get_bd_pins peripheral_aresetn_100M]
connect_bd_net [get_bd_pins proc_sys_reset_250M/peripheral_aresetn] \
  [get_bd_pins axi_interconnect_ad9144/M04_ARESETN] [get_bd_pins axi_interconnect_ad9144/ARESETN] \
  [get_bd_pins axi_interconnect_ad9144/S00_ARESETN] [get_bd_pins axi_interconnect_ad9144/M00_ARESETN] \
  [get_bd_pins axi_interconnect_ad9144/M01_ARESETN] [get_bd_pins axi_interconnect_ad9144/M02_ARESETN] \
  [get_bd_pins axi_interconnect_ad9144/M03_ARESETN] [get_bd_pins peripheral_aresetn_250M]
connect_bd_net [get_bd_pins proc_sys_reset_250M/peripheral_reset] [get_bd_pins peripheral_reset_250M]
connect_bd_net [get_bd_pins spi_miso] [get_bd_pins zynq_ultra_ps_e_0/emio_spi0_m_i]
connect_bd_net [get_bd_pins xlconcat_0/dout] [get_bd_pins spi_csn]
connect_bd_net [get_bd_pins zynq_ultra_ps_e_0/emio_spi0_m_o] [get_bd_pins spi_mosi]
connect_bd_net [get_bd_pins zynq_ultra_ps_e_0/emio_spi0_sclk_o] [get_bd_pins spi_clk]
connect_bd_net [get_bd_pins zynq_ultra_ps_e_0/emio_spi0_ss1_o_n] [get_bd_pins xlconcat_0/In1]
connect_bd_net [get_bd_pins zynq_ultra_ps_e_0/emio_spi0_ss2_o_n] [get_bd_pins xlconcat_0/In2]
connect_bd_net [get_bd_pins zynq_ultra_ps_e_0/emio_spi0_ss_o_n] [get_bd_pins xlconcat_0/In0]
connect_bd_net [get_bd_pins zynq_ultra_ps_e_0/pl_clk0] \
  [get_bd_pins zynq_ultra_ps_e_0/saxihp0_fpd_aclk] [get_bd_pins zynq_ultra_ps_e_0/maxihpm0_fpd_aclk] \
  [get_bd_pins axi_interconnect_ad9680/ACLK] [get_bd_pins axi_interconnect_ad9680/M01_ACLK] \
  [get_bd_pins axi_interconnect_ad9680/M00_ACLK] [get_bd_pins axi_interconnect_ad9680/S00_ACLK] \
  [get_bd_pins axi_interconnect_ad9680/M02_ACLK] [get_bd_pins axi_interconnect_ad9680/M03_ACLK] \
  [get_bd_pins axi_interconnect_ad9680/M04_ACLK] [get_bd_pins pl_clk_100M] [get_bd_pins proc_sys_reset_100M/slowest_sync_clk]
connect_bd_net [get_bd_pins zynq_ultra_ps_e_0/pl_clk1] \
  [get_bd_pins zynq_ultra_ps_e_0/saxihp1_fpd_aclk] [get_bd_pins zynq_ultra_ps_e_0/maxihpm1_fpd_aclk] \
  [get_bd_pins axi_interconnect_ad9144/M01_ACLK] [get_bd_pins axi_interconnect_ad9144/ACLK] \
  [get_bd_pins axi_interconnect_ad9144/S00_ACLK] [get_bd_pins axi_interconnect_ad9144/M00_ACLK] \
  [get_bd_pins axi_interconnect_ad9144/M02_ACLK] [get_bd_pins axi_interconnect_ad9144/M03_ACLK] \
  [get_bd_pins axi_interconnect_ad9144/M04_ACLK] [get_bd_pins pl_clk_250M] [get_bd_pins proc_sys_reset_250M/slowest_sync_clk]
connect_bd_net [get_bd_pins zynq_ultra_ps_e_0/pl_resetn0] \
  [get_bd_pins proc_sys_reset_250M/ext_reset_in] [get_bd_pins proc_sys_reset_100M/ext_reset_in] [get_bd_pins ext_reset_in]

current_bd_instance /jesd204b
connect_bd_intf_net [get_bd_intf_pins s_axi_ad9144_xcvr] [get_bd_intf_pins phy_shared_0/s_axi_ad9144_xcvr]
connect_bd_intf_net [get_bd_intf_pins s_axi_ad9680_xcvr] [get_bd_intf_pins phy_shared_0/s_axi_ad9680_xcvr]
connect_bd_intf_net [get_bd_intf_pins m_axi_ad9680_dma] [get_bd_intf_pins adc/m_axi_ad9680_dma]
connect_bd_intf_net [get_bd_intf_pins s_axi_ad9680_jesd] [get_bd_intf_pins adc/s_axi_ad9680_jesd]
connect_bd_intf_net [get_bd_intf_pins s_axi_ad9680_tpl] [get_bd_intf_pins adc/s_axi_ad9680_tpl]
connect_bd_intf_net [get_bd_intf_pins s_axi_ad9680_dma] [get_bd_intf_pins adc/s_axi_ad9680_dma]
connect_bd_intf_net [get_bd_intf_pins s_axi_ad9680_offload] [get_bd_intf_pins adc/s_axi_ad9680_offload]
connect_bd_intf_net [get_bd_intf_pins s_axi_ad9144_tpl] [get_bd_intf_pins dac/s_axi_ad9144_tpl]
connect_bd_intf_net [get_bd_intf_pins s_axi_ad9144_jesd] [get_bd_intf_pins dac/s_axi_ad9144_jesd]
connect_bd_intf_net [get_bd_intf_pins s_axi_ad9144_dma] [get_bd_intf_pins dac/s_axi_ad9144_dma]
connect_bd_intf_net [get_bd_intf_pins s_axi_gpio_counter] [get_bd_intf_pins dac/s_axi_gpio_counter]
connect_bd_intf_net [get_bd_intf_pins m_axi_dma_ad9144] [get_bd_intf_pins dac/m_axi_dma_ad9144]
connect_bd_net [get_bd_pins adc/adc_irq] [get_bd_pins xlconcat_0/In0]
connect_bd_net [get_bd_pins adc/phy_en_char_align] [get_bd_pins phy_shared_0/phy_rx_calign]
connect_bd_net [get_bd_pins adc/rx_sync] [get_bd_pins rx_sync]
connect_bd_net [get_bd_pins dac/dac_irq] [get_bd_pins xlconcat_0/In1]
connect_bd_net [get_bd_pins dac/phy_charisk] [get_bd_pins phy_shared_0/phy_tx_charisk]
connect_bd_net [get_bd_pins dac/phy_data] [get_bd_pins phy_shared_0/phy_tx_data]
connect_bd_net [get_bd_pins dac/phy_header] [get_bd_pins phy_shared_0/phy_tx_header]
connect_bd_net [get_bd_pins ext_reset_in] [get_bd_pins adc/ext_reset_in]
connect_bd_net [get_bd_pins phy_shared_0/phy_rx_block_sync] [get_bd_pins adc/phy_block_sync]
connect_bd_net [get_bd_pins phy_shared_0/phy_rx_charisk] [get_bd_pins adc/phy_charisk]
connect_bd_net [get_bd_pins phy_shared_0/phy_rx_data] [get_bd_pins adc/phy_data]
connect_bd_net [get_bd_pins phy_shared_0/phy_rx_disperr] [get_bd_pins adc/phy_disperr]
connect_bd_net [get_bd_pins phy_shared_0/phy_rx_header] [get_bd_pins adc/phy_header]
connect_bd_net [get_bd_pins phy_shared_0/phy_rx_notintable] [get_bd_pins adc/phy_notintable]
connect_bd_net [get_bd_pins phy_shared_0/rx_out_clk_0] [get_bd_pins adc/rx_out_clk_0]
connect_bd_net [get_bd_pins phy_shared_0/tx_0_n] [get_bd_pins tx_0_n]
connect_bd_net [get_bd_pins phy_shared_0/tx_0_p] [get_bd_pins tx_0_p]
connect_bd_net [get_bd_pins phy_shared_0/tx_1_n] [get_bd_pins tx_1_n]
connect_bd_net [get_bd_pins phy_shared_0/tx_1_p] [get_bd_pins tx_1_p]
connect_bd_net [get_bd_pins phy_shared_0/tx_2_n] [get_bd_pins tx_2_n]
connect_bd_net [get_bd_pins phy_shared_0/tx_2_p] [get_bd_pins tx_2_p]
connect_bd_net [get_bd_pins phy_shared_0/tx_3_n] [get_bd_pins tx_3_n]
connect_bd_net [get_bd_pins phy_shared_0/tx_3_p] [get_bd_pins tx_3_p]
connect_bd_net [get_bd_pins phy_shared_0/tx_out_clk_0] [get_bd_pins dac/tx_out_clk_0]
connect_bd_net [get_bd_pins reset_upack] [get_bd_pins dac/reset_upack]
connect_bd_net [get_bd_pins rx_0_n] [get_bd_pins phy_shared_0/rx_0_n]
connect_bd_net [get_bd_pins rx_0_p] [get_bd_pins phy_shared_0/rx_0_p]
connect_bd_net [get_bd_pins rx_1_n] [get_bd_pins phy_shared_0/rx_1_n]
connect_bd_net [get_bd_pins rx_1_p] [get_bd_pins phy_shared_0/rx_1_p]
connect_bd_net [get_bd_pins rx_2_n] [get_bd_pins phy_shared_0/rx_2_n]
connect_bd_net [get_bd_pins rx_2_p] [get_bd_pins phy_shared_0/rx_2_p]
connect_bd_net [get_bd_pins rx_3_n] [get_bd_pins phy_shared_0/rx_3_n]
connect_bd_net [get_bd_pins rx_3_p] [get_bd_pins phy_shared_0/rx_3_p]
connect_bd_net [get_bd_pins rx_ref_clk] [get_bd_pins phy_shared_0/rx_ref_clk]
connect_bd_net [get_bd_pins rx_sysref] [get_bd_pins adc/rx_sysref]
connect_bd_net -net s_axi_ad9144_aclk_1 [get_bd_pins s_axi_aclk_250M] [get_bd_pins phy_shared_0/s_axi_ad9144_aclk] [get_bd_pins dac/pl_clk_250M]
connect_bd_net -net s_axi_ad9144_aresetn_1 [get_bd_pins s_axi_aresetn_250M] \
  [get_bd_pins phy_shared_0/s_axi_ad9144_aresetn] [get_bd_pins dac/peripheral_aresetn_250M]
connect_bd_net -net s_axi_ad9680_aclk_1 [get_bd_pins s_axi_aclk_100M] \
  [get_bd_pins phy_shared_0/s_axi_ad9680_aclk] [get_bd_pins phy_shared_0/sys_cpu_clk] [get_bd_pins adc/pl_clk_100M]
connect_bd_net -net s_axi_ad9680_aresetn_1 [get_bd_pins s_axi_aresetn_100M] \
  [get_bd_pins phy_shared_0/s_axi_ad9680_aresetn] [get_bd_pins phy_shared_0/sys_cpu_resetn] \
  [get_bd_pins adc/peripheral_aresetn_100M]
connect_bd_net [get_bd_pins tx_ref_clk] [get_bd_pins phy_shared_0/tx_ref_clk]
connect_bd_net [get_bd_pins tx_sync] [get_bd_pins dac/tx_sync]
connect_bd_net [get_bd_pins tx_sysref] [get_bd_pins dac/tx_sysref]
connect_bd_net [get_bd_pins xlconcat_0/dout] [get_bd_pins jesd204b_irq]

current_bd_instance /jesd204b/adc
connect_bd_intf_net [get_bd_intf_pins m_axi_ad9680_dma] [get_bd_intf_pins axi_ad9680_dma/m_dest_axi]
connect_bd_intf_net [get_bd_intf_pins s_axi_ad9680_dma] [get_bd_intf_pins axi_ad9680_dma/s_axi]
connect_bd_intf_net [get_bd_intf_pins s_axi_ad9680_jesd] [get_bd_intf_pins axi_ad9680_jesd/s_axi]
connect_bd_intf_net [get_bd_intf_pins s_axi_ad9680_offload] [get_bd_intf_pins axi_ad9680_offload/s_axi]
connect_bd_intf_net [get_bd_intf_pins s_axi_ad9680_tpl] [get_bd_intf_pins axi_ad9680_tpl/s_axi]
connect_bd_intf_net [get_bd_intf_pins axi_ad9680_dma/s_axis] [get_bd_intf_pins axi_ad9680_offload/m_axis]
connect_bd_net [get_bd_pins axi_ad9680_cpack/fifo_wr_overflow] [get_bd_pins axi_ad9680_tpl/adc_dovf]
connect_bd_net [get_bd_pins axi_ad9680_cpack/packed_fifo_wr_data] [get_bd_pins axi_ad9680_offload/s_axis_tdata]
connect_bd_net [get_bd_pins axi_ad9680_cpack/packed_fifo_wr_en] [get_bd_pins axi_ad9680_offload/s_axis_tvalid]
connect_bd_net [get_bd_pins axi_ad9680_dma/irq] [get_bd_pins xlconcat_irq/In1]
connect_bd_net [get_bd_pins axi_ad9680_dma/s_axis_xfer_req] [get_bd_pins axi_ad9680_offload/init_req]
connect_bd_net -net axi_ad9680_jesd_0_irq [get_bd_pins axi_ad9680_jesd/irq] [get_bd_pins xlconcat_irq/In0]
connect_bd_net -net axi_ad9680_jesd_0_phy_en_char_align [get_bd_pins axi_ad9680_jesd/phy_en_char_align] [get_bd_pins phy_en_char_align]
connect_bd_net -net axi_ad9680_jesd_0_rx_data_tdata [get_bd_pins axi_ad9680_jesd/rx_data_tdata] [get_bd_pins axi_ad9680_tpl/link_data]
connect_bd_net -net axi_ad9680_jesd_0_rx_data_tvalid [get_bd_pins axi_ad9680_jesd/rx_data_tvalid] [get_bd_pins axi_ad9680_tpl/link_valid]
connect_bd_net -net axi_ad9680_jesd_0_rx_sof [get_bd_pins axi_ad9680_jesd/rx_sof] [get_bd_pins axi_ad9680_tpl/link_sof]
connect_bd_net -net axi_ad9680_jesd_0_rx_sync [get_bd_pins axi_ad9680_jesd/rx_sync] [get_bd_pins rx_sync]
connect_bd_net [get_bd_pins axi_ad9680_tpl/adc_data_0] [get_bd_pins axi_ad9680_cpack/fifo_wr_data_0]
connect_bd_net [get_bd_pins axi_ad9680_tpl/adc_data_1] [get_bd_pins axi_ad9680_cpack/fifo_wr_data_1]
connect_bd_net [get_bd_pins axi_ad9680_tpl/adc_enable_0] [get_bd_pins axi_ad9680_cpack/enable_0]
connect_bd_net [get_bd_pins axi_ad9680_tpl/adc_enable_1] [get_bd_pins axi_ad9680_cpack/enable_1]
connect_bd_net [get_bd_pins axi_ad9680_tpl/adc_valid_0] [get_bd_pins axi_ad9680_cpack/fifo_wr_en]
connect_bd_net -net device_clk_1 [get_bd_pins rx_out_clk_0] \
  [get_bd_pins axi_ad9680_jesd/device_clk] [get_bd_pins axi_ad9680_jesd/link_clk] [get_bd_pins axi_ad9680_tpl/link_clk] \
  [get_bd_pins axi_ad9680_cpack/clk] [get_bd_pins axi_ad9680_rstgen/slowest_sync_clk] \
  [get_bd_pins axi_ad9680_offload/s_axis_aclk]
connect_bd_net [get_bd_pins ext_reset_in] [get_bd_pins axi_ad9680_rstgen/ext_reset_in]
connect_bd_net [get_bd_pins peripheral_aresetn_100M] \
  [get_bd_pins axi_ad9680_jesd/s_axi_aresetn] [get_bd_pins axi_ad9680_tpl/s_axi_aresetn] \
  [get_bd_pins axi_ad9680_offload/s_axi_aresetn] [get_bd_pins axi_ad9680_offload/m_axis_aresetn] \
  [get_bd_pins axi_ad9680_dma/axi_aresetn]
connect_bd_net [get_bd_pins phy_block_sync] [get_bd_pins axi_ad9680_jesd/phy_block_sync]
connect_bd_net [get_bd_pins phy_charisk] [get_bd_pins axi_ad9680_jesd/phy_charisk]
connect_bd_net [get_bd_pins phy_data] [get_bd_pins axi_ad9680_jesd/phy_data]
connect_bd_net [get_bd_pins phy_disperr] [get_bd_pins axi_ad9680_jesd/phy_disperr]
connect_bd_net [get_bd_pins phy_header] [get_bd_pins axi_ad9680_jesd/phy_header]
connect_bd_net [get_bd_pins phy_notintable] [get_bd_pins axi_ad9680_jesd/phy_notintable]
connect_bd_net [get_bd_pins pl_clk_100M] \
  [get_bd_pins axi_ad9680_jesd/s_axi_aclk] [get_bd_pins axi_ad9680_tpl/s_axi_aclk] \
  [get_bd_pins axi_ad9680_offload/s_axi_aclk] [get_bd_pins axi_ad9680_offload/m_axis_aclk] \
  [get_bd_pins axi_ad9680_dma/m_dest_axi_aclk]
connect_bd_net -net reset_1 [get_bd_pins axi_ad9680_rstgen/peripheral_reset] [get_bd_pins axi_ad9680_cpack/reset]
connect_bd_net [get_bd_pins rx_sysref] [get_bd_pins axi_ad9680_jesd/sysref]
connect_bd_net -net s_axis_aresetn_1 [get_bd_pins axi_ad9680_rstgen/peripheral_aresetn] [get_bd_pins axi_ad9680_offload/s_axis_aresetn]
connect_bd_net [get_bd_pins xlconcat_irq/dout] [get_bd_pins adc_irq]

current_bd_instance /jesd204b/adc/axi_ad9680_offload
connect_bd_intf_net [get_bd_intf_pins m_axis] [get_bd_intf_pins i_data_offload/m_axis]
connect_bd_intf_net [get_bd_intf_pins i_data_offload/m_storage_axis] [get_bd_intf_pins storage_unit/s_axis]
connect_bd_intf_net [get_bd_intf_pins s_axi] [get_bd_intf_pins i_data_offload/s_axi]
connect_bd_intf_net [get_bd_intf_pins s_axis] [get_bd_intf_pins i_data_offload/s_axis]
connect_bd_intf_net [get_bd_intf_pins storage_unit/m_axis] [get_bd_intf_pins i_data_offload/s_storage_axis]
connect_bd_net [get_bd_pins GND/dout] [get_bd_pins i_data_offload/sync_ext]
connect_bd_net [get_bd_pins i_data_offload/rd_request_enable] [get_bd_pins storage_unit/rd_request_enable]
connect_bd_net [get_bd_pins i_data_offload/rd_request_length] [get_bd_pins storage_unit/rd_request_length]
connect_bd_net [get_bd_pins i_data_offload/rd_request_valid] [get_bd_pins storage_unit/rd_request_valid]
connect_bd_net [get_bd_pins i_data_offload/wr_request_enable] [get_bd_pins storage_unit/wr_request_enable]
connect_bd_net [get_bd_pins i_data_offload/wr_request_length] [get_bd_pins storage_unit/wr_request_length]
connect_bd_net [get_bd_pins i_data_offload/wr_request_valid] [get_bd_pins storage_unit/wr_request_valid]
connect_bd_net [get_bd_pins init_req] [get_bd_pins i_data_offload/init_req]
connect_bd_net [get_bd_pins m_axis_aclk] [get_bd_pins storage_unit/m_axis_aclk] [get_bd_pins i_data_offload/m_axis_aclk]
connect_bd_net [get_bd_pins m_axis_aresetn] [get_bd_pins storage_unit/m_axis_aresetn] [get_bd_pins i_data_offload/m_axis_aresetn]
connect_bd_net [get_bd_pins s_axi_aclk] [get_bd_pins i_data_offload/s_axi_aclk]
connect_bd_net [get_bd_pins s_axi_aresetn] [get_bd_pins i_data_offload/s_axi_aresetn]
connect_bd_net [get_bd_pins s_axis_aclk] [get_bd_pins storage_unit/s_axis_aclk] [get_bd_pins i_data_offload/s_axis_aclk]
connect_bd_net [get_bd_pins s_axis_aresetn] [get_bd_pins storage_unit/s_axis_aresetn] [get_bd_pins i_data_offload/s_axis_aresetn]
connect_bd_net [get_bd_pins storage_unit/rd_request_ready] [get_bd_pins i_data_offload/rd_request_ready]
connect_bd_net [get_bd_pins storage_unit/rd_response_eot] [get_bd_pins i_data_offload/rd_response_eot]
connect_bd_net [get_bd_pins storage_unit/wr_request_ready] [get_bd_pins i_data_offload/wr_request_ready]
connect_bd_net [get_bd_pins storage_unit/wr_response_eot] [get_bd_pins i_data_offload/wr_response_eot]
connect_bd_net [get_bd_pins storage_unit/wr_response_measured_length] [get_bd_pins i_data_offload/wr_response_measured_length]

current_bd_instance /jesd204b/adc/axi_ad9680_dma
connect_bd_intf_net -intf_net axi_dmac_0_m_dest_axi [get_bd_intf_pins m_dest_axi] [get_bd_intf_pins axi_dmac/m_dest_axi]
connect_bd_intf_net [get_bd_intf_pins s_axi] [get_bd_intf_pins axi_dmac/s_axi]
connect_bd_intf_net [get_bd_intf_pins s_axis] [get_bd_intf_pins axi_dmac/s_axis]
connect_bd_net [get_bd_pins axi_aresetn] [get_bd_pins axi_dmac/s_axi_aresetn] [get_bd_pins axi_dmac/m_dest_axi_aresetn]
connect_bd_net -net axi_dmac_0_irq [get_bd_pins axi_dmac/irq] [get_bd_pins irq]
connect_bd_net -net axi_dmac_0_s_axis_xfer_req [get_bd_pins axi_dmac/s_axis_xfer_req] [get_bd_pins s_axis_xfer_req]
connect_bd_net [get_bd_pins m_dest_axi_aclk] \
  [get_bd_pins axi_dmac/m_dest_axi_aclk] [get_bd_pins axi_dmac/s_axi_aclk] [get_bd_pins axi_dmac/m_src_axi_aclk] \
  [get_bd_pins axi_dmac/m_sg_axi_aclk] [get_bd_pins axi_dmac/s_axis_aclk] [get_bd_pins axi_dmac/m_axis_aclk] \
  [get_bd_pins axi_dmac/fifo_wr_clk] [get_bd_pins axi_dmac/fifo_rd_clk]

current_bd_instance /jesd204b/adc/axi_ad9680_cpack
connect_bd_net [get_bd_pins axi_ad9680_cpack/fifo_wr_overflow] [get_bd_pins fifo_wr_overflow]
connect_bd_net [get_bd_pins axi_ad9680_cpack/packed_fifo_wr_data] [get_bd_pins packed_fifo_wr_data]
connect_bd_net [get_bd_pins axi_ad9680_cpack/packed_fifo_wr_en] [get_bd_pins packed_fifo_wr_en]
connect_bd_net [get_bd_pins clk] [get_bd_pins axi_ad9680_cpack/clk]
connect_bd_net -net enable_0_1 [get_bd_pins enable_0] [get_bd_pins axi_ad9680_cpack/enable_0]
connect_bd_net -net enable_1_1 [get_bd_pins enable_1] [get_bd_pins axi_ad9680_cpack/enable_1]
connect_bd_net -net fifo_wr_data_0_1 [get_bd_pins fifo_wr_data_0] [get_bd_pins axi_ad9680_cpack/fifo_wr_data_0]
connect_bd_net -net fifo_wr_data_1_1 [get_bd_pins fifo_wr_data_1] [get_bd_pins axi_ad9680_cpack/fifo_wr_data_1]
connect_bd_net [get_bd_pins fifo_wr_en] [get_bd_pins axi_ad9680_cpack/fifo_wr_en]
connect_bd_net [get_bd_pins reset] [get_bd_pins axi_ad9680_cpack/reset]

current_bd_instance /jesd204b/dac
connect_bd_intf_net [get_bd_intf_pins m_axi_dma_ad9144] [get_bd_intf_pins axi_ad9144_dma/M_AXI_MM2S]
connect_bd_intf_net [get_bd_intf_pins s_axi_ad9144_dma] [get_bd_intf_pins axi_ad9144_dma/S_AXI_LITE]
connect_bd_intf_net [get_bd_intf_pins s_axi_ad9144_jesd] [get_bd_intf_pins axi_ad9144_jesd/s_axi]
connect_bd_intf_net [get_bd_intf_pins s_axi_ad9144_tpl] [get_bd_intf_pins axi_ad9144_tpl/s_axi]
connect_bd_intf_net [get_bd_intf_pins s_axi_gpio_counter] [get_bd_intf_pins axi_gpio_0/S_AXI]
connect_bd_net [get_bd_pins axi_ad9144_dma/m_axis_mm2s_tdata] [get_bd_pins axi_ad9144_upack/s_axis_data]
connect_bd_net [get_bd_pins axi_ad9144_dma/m_axis_mm2s_tvalid] [get_bd_pins axi_ad9144_upack/s_axis_valid] [get_bd_pins counter_ceil_0/start]
connect_bd_net [get_bd_pins axi_ad9144_dma/mm2s_introut] [get_bd_pins xlconcat_irq/In1]
connect_bd_net [get_bd_pins axi_ad9144_jesd/irq] [get_bd_pins xlconcat_irq/In0]
connect_bd_net [get_bd_pins axi_ad9144_jesd/phy_charisk] [get_bd_pins phy_charisk]
connect_bd_net [get_bd_pins axi_ad9144_jesd/phy_data] [get_bd_pins phy_data]
connect_bd_net [get_bd_pins axi_ad9144_jesd/phy_header] [get_bd_pins phy_header]
connect_bd_net [get_bd_pins axi_ad9144_jesd/tx_ready] [get_bd_pins axi_ad9144_tpl/link_ready]
connect_bd_net [get_bd_pins axi_ad9144_tpl/dac_enable_0] [get_bd_pins axi_ad9144_upack/enable_0]
connect_bd_net [get_bd_pins axi_ad9144_tpl/dac_enable_1] [get_bd_pins axi_ad9144_upack/enable_1]
connect_bd_net [get_bd_pins axi_ad9144_tpl/dac_valid_0] [get_bd_pins axi_ad9144_upack/fifo_rd_en]
connect_bd_net [get_bd_pins axi_ad9144_tpl/link_data] [get_bd_pins axi_ad9144_jesd/tx_data]
connect_bd_net [get_bd_pins axi_ad9144_tpl/link_valid] [get_bd_pins axi_ad9144_jesd/tx_valid]
connect_bd_net [get_bd_pins axi_ad9144_upack/fifo_rd_data_0] [get_bd_pins axi_ad9144_tpl/dac_data_0]
connect_bd_net [get_bd_pins axi_ad9144_upack/fifo_rd_data_1] [get_bd_pins axi_ad9144_tpl/dac_data_1]
connect_bd_net [get_bd_pins axi_ad9144_upack/fifo_rd_underflow] [get_bd_pins axi_ad9144_tpl/dac_dunf]
connect_bd_net [get_bd_pins axi_gpio_0/gpio2_io_o] [get_bd_pins counter_ceil_0/ceil]
connect_bd_net -net clk_1 [get_bd_pins tx_out_clk_0] \
  [get_bd_pins axi_ad9144_upack/clk] [get_bd_pins axi_ad9144_jesd/device_clk] [get_bd_pins axi_ad9144_jesd/link_clk] \
  [get_bd_pins axi_ad9144_tpl/link_clk]
connect_bd_net [get_bd_pins counter_ceil_0/done] [get_bd_pins axi_gpio_0/gpio_io_i]
connect_bd_net [get_bd_pins peripheral_aresetn_250M] \
  [get_bd_pins axi_gpio_0/s_axi_aresetn] [get_bd_pins axi_ad9144_dma/axi_resetn] [get_bd_pins axi_ad9144_jesd/s_axi_aresetn] \
  [get_bd_pins counter_ceil_0/rst] [get_bd_pins axi_ad9144_tpl/s_axi_aresetn]
connect_bd_net [get_bd_pins pl_clk_250M] \
  [get_bd_pins axi_gpio_0/s_axi_aclk] [get_bd_pins axi_ad9144_dma/s_axi_lite_aclk] \
  [get_bd_pins axi_ad9144_dma/m_axi_mm2s_aclk] [get_bd_pins axi_ad9144_jesd/s_axi_aclk] [get_bd_pins counter_ceil_0/clk] \
  [get_bd_pins axi_ad9144_tpl/s_axi_aclk]
connect_bd_net -net reset_upak_1 [get_bd_pins reset_upack] [get_bd_pins axi_ad9144_upack/reset]
connect_bd_net [get_bd_pins tx_sync] [get_bd_pins axi_ad9144_jesd/sync]
connect_bd_net [get_bd_pins tx_sysref] [get_bd_pins axi_ad9144_jesd/sysref]
connect_bd_net -net xlconcat_0_dout [get_bd_pins xlconcat_irq/dout] [get_bd_pins dac_irq]

current_bd_instance /jesd204b/dac/axi_ad9144_upack
connect_bd_net [get_bd_pins clk] [get_bd_pins util_upack2_0/clk]
connect_bd_net -net enable_0_1 [get_bd_pins enable_0] [get_bd_pins util_upack2_0/enable_0]
connect_bd_net -net enable_1_1 [get_bd_pins enable_1] [get_bd_pins util_upack2_0/enable_1]
connect_bd_net [get_bd_pins fifo_rd_en] [get_bd_pins util_upack2_0/fifo_rd_en]
connect_bd_net [get_bd_pins reset] [get_bd_pins util_upack2_0/reset]
connect_bd_net [get_bd_pins s_axis_data] [get_bd_pins util_upack2_0/s_axis_data]
connect_bd_net [get_bd_pins s_axis_valid] [get_bd_pins util_upack2_0/s_axis_valid]
connect_bd_net [get_bd_pins util_upack2_0/fifo_rd_data_0] [get_bd_pins fifo_rd_data_0]
connect_bd_net [get_bd_pins util_upack2_0/fifo_rd_data_1] [get_bd_pins fifo_rd_data_1]
connect_bd_net [get_bd_pins util_upack2_0/fifo_rd_underflow] [get_bd_pins fifo_rd_underflow]

current_bd_instance /
connect_bd_intf_net [get_bd_intf_ports gpio] [get_bd_intf_pins PS/gpio]
connect_bd_intf_net [get_bd_intf_pins PS/m_axi_ad9144_dma] [get_bd_intf_pins jesd204b/s_axi_ad9144_dma]
connect_bd_intf_net [get_bd_intf_pins PS/m_axi_ad9144_jesd] [get_bd_intf_pins jesd204b/s_axi_ad9144_jesd]
connect_bd_intf_net [get_bd_intf_pins PS/m_axi_ad9144_tpl] [get_bd_intf_pins jesd204b/s_axi_ad9144_tpl]
connect_bd_intf_net [get_bd_intf_pins PS/m_axi_ad9144_xcvr] [get_bd_intf_pins jesd204b/s_axi_ad9144_xcvr]
connect_bd_intf_net [get_bd_intf_pins PS/m_axi_ad9680_dma] [get_bd_intf_pins jesd204b/s_axi_ad9680_dma]
connect_bd_intf_net [get_bd_intf_pins PS/m_axi_ad9680_jesd] [get_bd_intf_pins jesd204b/s_axi_ad9680_jesd]
connect_bd_intf_net [get_bd_intf_pins PS/m_axi_ad9680_offload] [get_bd_intf_pins jesd204b/s_axi_ad9680_offload]
connect_bd_intf_net [get_bd_intf_pins PS/m_axi_ad9680_tpl] [get_bd_intf_pins jesd204b/s_axi_ad9680_tpl]
connect_bd_intf_net [get_bd_intf_pins PS/m_axi_ad9680_xcvr] [get_bd_intf_pins jesd204b/s_axi_ad9680_xcvr]
connect_bd_intf_net [get_bd_intf_pins PS/m_axi_gpio_counter] [get_bd_intf_pins jesd204b/s_axi_gpio_counter]
connect_bd_intf_net -intf_net s_axi_dma_ad9144_1 [get_bd_intf_pins PS/s_axi_dma_ad9144] [get_bd_intf_pins jesd204b/m_axi_dma_ad9144]
connect_bd_intf_net -intf_net s_axi_dma_ad9680_1 [get_bd_intf_pins PS/s_axi_dma_ad9680] [get_bd_intf_pins jesd204b/m_axi_ad9680_dma]
connect_bd_net [get_bd_pins PS/ext_reset_in] [get_bd_pins jesd204b/ext_reset_in]
connect_bd_net [get_bd_pins PS/peripheral_aresetn_100M] [get_bd_pins jesd204b/s_axi_aresetn_100M]
connect_bd_net [get_bd_pins PS/peripheral_aresetn_250M] [get_bd_pins jesd204b/s_axi_aresetn_250M]
connect_bd_net [get_bd_pins PS/peripheral_reset_250M] [get_bd_pins jesd204b/reset_upack]
connect_bd_net [get_bd_pins PS/pl_clk_100M] [get_bd_pins jesd204b/s_axi_aclk_100M]
connect_bd_net [get_bd_pins PS/pl_clk_250M] [get_bd_pins jesd204b/s_axi_aclk_250M]
connect_bd_net [get_bd_pins PS/spi_clk] [get_bd_ports spi_clk]
connect_bd_net [get_bd_pins PS/spi_csn] [get_bd_ports spi_csn]
connect_bd_net [get_bd_pins PS/spi_mosi] [get_bd_ports spi_mosi]
connect_bd_net [get_bd_pins jesd204b/jesd204b_irq] [get_bd_pins PS/pl_ps_irq0]
connect_bd_net [get_bd_pins jesd204b/rx_sync] [get_bd_ports rx_sync]
connect_bd_net [get_bd_pins jesd204b/tx_0_n] [get_bd_ports tx_0_n]
connect_bd_net [get_bd_pins jesd204b/tx_0_p] [get_bd_ports tx_0_p]
connect_bd_net [get_bd_pins jesd204b/tx_1_n] [get_bd_ports tx_1_n]
connect_bd_net [get_bd_pins jesd204b/tx_1_p] [get_bd_ports tx_1_p]
connect_bd_net [get_bd_pins jesd204b/tx_2_n] [get_bd_ports tx_2_n]
connect_bd_net [get_bd_pins jesd204b/tx_2_p] [get_bd_ports tx_2_p]
connect_bd_net [get_bd_pins jesd204b/tx_3_n] [get_bd_ports tx_3_n]
connect_bd_net [get_bd_pins jesd204b/tx_3_p] [get_bd_ports tx_3_p]
connect_bd_net [get_bd_ports rx_0_n] [get_bd_pins jesd204b/rx_0_n]
connect_bd_net [get_bd_ports rx_0_p] [get_bd_pins jesd204b/rx_0_p]
connect_bd_net [get_bd_ports rx_1_n] [get_bd_pins jesd204b/rx_1_n]
connect_bd_net [get_bd_ports rx_1_p] [get_bd_pins jesd204b/rx_1_p]
connect_bd_net [get_bd_ports rx_2_n] [get_bd_pins jesd204b/rx_2_n]
connect_bd_net [get_bd_ports rx_2_p] [get_bd_pins jesd204b/rx_2_p]
connect_bd_net [get_bd_ports rx_3_n] [get_bd_pins jesd204b/rx_3_n]
connect_bd_net [get_bd_ports rx_3_p] [get_bd_pins jesd204b/rx_3_p]
connect_bd_net [get_bd_ports rx_ref_clk] [get_bd_pins jesd204b/rx_ref_clk]
connect_bd_net [get_bd_ports rx_sysref] [get_bd_pins jesd204b/rx_sysref]
connect_bd_net [get_bd_ports spi_miso] [get_bd_pins PS/spi_miso]
connect_bd_net [get_bd_ports tx_ref_clk] [get_bd_pins jesd204b/tx_ref_clk]
connect_bd_net [get_bd_ports tx_sync] [get_bd_pins jesd204b/tx_sync]
connect_bd_net [get_bd_ports tx_sysref] [get_bd_pins jesd204b/tx_sysref]

# ---- address map ----
assign_bd_address -offset 0x40000000 -range 1G -target_address_space [get_bd_addr_spaces jesd204b/adc/axi_ad9680_dma/axi_dmac/m_dest_axi] [get_bd_addr_segs PS/zynq_ultra_ps_e_0/SAXIGP2/HP0_DDR_LOW]
assign_bd_address -offset 0xFF000000 -range 16M -target_address_space [get_bd_addr_spaces jesd204b/adc/axi_ad9680_dma/axi_dmac/m_dest_axi] [get_bd_addr_segs PS/zynq_ultra_ps_e_0/SAXIGP2/HP0_LPS_OCM]
exclude_bd_addr_seg -offset 0x00000000 -range 1 -target_address_space [get_bd_addr_spaces jesd204b/adc/axi_ad9680_dma/axi_dmac/m_dest_axi] [get_bd_addr_segs PS/zynq_ultra_ps_e_0/SAXIGP2/HP0_DDR_HIGH]
assign_bd_address -offset 0x40000000 -range 1G -target_address_space [get_bd_addr_spaces jesd204b/dac/axi_ad9144_dma/Data_MM2S] [get_bd_addr_segs PS/zynq_ultra_ps_e_0/SAXIGP3/HP1_DDR_LOW]
exclude_bd_addr_seg -offset 0x00000000 -range 1 -target_address_space [get_bd_addr_spaces jesd204b/dac/axi_ad9144_dma/Data_MM2S] [get_bd_addr_segs PS/zynq_ultra_ps_e_0/SAXIGP3/HP1_DDR_HIGH]
exclude_bd_addr_seg -offset 0xFF000000 -range 16M -target_address_space [get_bd_addr_spaces jesd204b/dac/axi_ad9144_dma/Data_MM2S] [get_bd_addr_segs PS/zynq_ultra_ps_e_0/SAXIGP3/HP1_LPS_OCM]
assign_bd_address -offset 0x00A0000000 -range 64K -target_address_space [get_bd_addr_spaces PS/zynq_ultra_ps_e_0/Data] [get_bd_addr_segs jesd204b/phy_shared_0/s_axi_ad9680_xcvr/reg0]
assign_bd_address -offset 0x00A0010000 -range 4K -target_address_space [get_bd_addr_spaces PS/zynq_ultra_ps_e_0/Data] [get_bd_addr_segs jesd204b/adc/axi_ad9680_dma/axi_dmac/s_axi/reg0]
assign_bd_address -offset 0x00A0012000 -range 8K -target_address_space [get_bd_addr_spaces PS/zynq_ultra_ps_e_0/Data] [get_bd_addr_segs jesd204b/adc/axi_ad9680_tpl/s_axi/reg0]
assign_bd_address -offset 0x00A0014000 -range 16K -target_address_space [get_bd_addr_spaces PS/zynq_ultra_ps_e_0/Data] [get_bd_addr_segs jesd204b/adc/axi_ad9680_jesd/s_axi/reg0]
assign_bd_address -offset 0x00A0020000 -range 64K -target_address_space [get_bd_addr_spaces PS/zynq_ultra_ps_e_0/Data] [get_bd_addr_segs jesd204b/adc/axi_ad9680_offload/i_data_offload/s_axi/reg0]
assign_bd_address -offset 0x00B0000000 -range 16K -target_address_space [get_bd_addr_spaces PS/zynq_ultra_ps_e_0/Data] [get_bd_addr_segs jesd204b/dac/axi_ad9144_jesd/s_axi/reg0]
assign_bd_address -offset 0x00B0004000 -range 8K -target_address_space [get_bd_addr_spaces PS/zynq_ultra_ps_e_0/Data] [get_bd_addr_segs jesd204b/dac/axi_ad9144_tpl/s_axi/reg0]
assign_bd_address -offset 0x00B0010000 -range 64K -target_address_space [get_bd_addr_spaces PS/zynq_ultra_ps_e_0/Data] [get_bd_addr_segs jesd204b/phy_shared_0/s_axi_ad9144_xcvr/reg0]
assign_bd_address -offset 0x00B0020000 -range 64K -target_address_space [get_bd_addr_spaces PS/zynq_ultra_ps_e_0/Data] [get_bd_addr_segs jesd204b/dac/axi_ad9144_dma/S_AXI_LITE/Reg]
assign_bd_address -offset 0x00B0030000 -range 64K -target_address_space [get_bd_addr_spaces PS/zynq_ultra_ps_e_0/Data] [get_bd_addr_segs jesd204b/dac/axi_gpio_0/S_AXI/Reg]

validate_bd_design
save_bd_design
